# Altium schematic sheet Rectifier_Unit.SchDoc
size A3
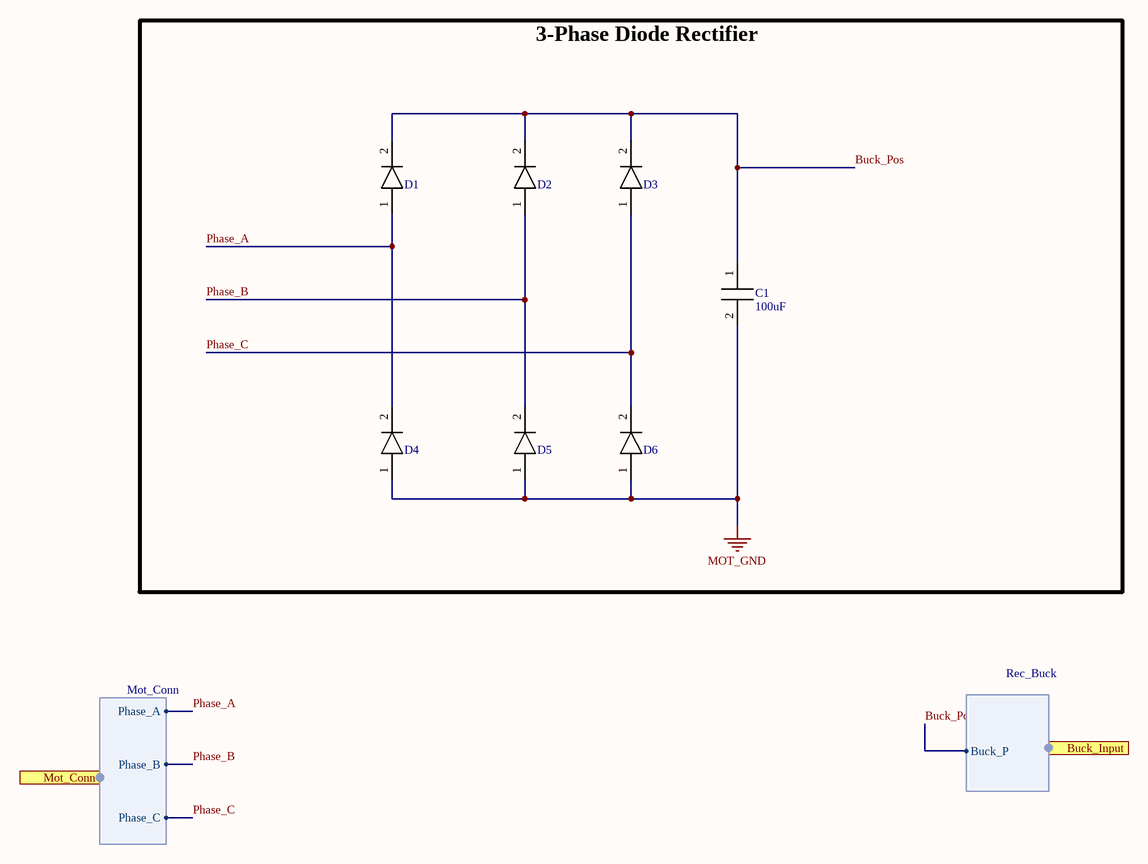
[diagram p0: Rectifier_Unit.SchDoc]

## Parts
C1  Parameter 1: 100uF  [EKXL401ELL101MM25S]  (hidden comment: CAP 100uf EKXL401ELL101MM25S)
D1  DI S2GTR  [S2GTR]  (value not drawn)
D2  DI S2GTR  [S2GTR]  (value not drawn)
D3  DI S2GTR  [S2GTR]  (value not drawn)
D4  DI S2GTR  [S2GTR]  (value not drawn)
D5  DI S2GTR  [S2GTR]  (value not drawn)
D6  DI S2GTR  [S2GTR]  (value not drawn)

## Ports
Buck_Input (harness Rec_Buck), Mot_Conn (harness Mot_Conn)

## Harnesses
Mot_Conn: Phase_A, Phase_B, Phase_C
Rec_Buck: Buck_P

## Nets
MOT_GND: C1.2 D4.1(Anode) D5.1(Anode) D6.1(Anode)
Buck_Pos: C1.1 D1.2(Cathode) D2.2(Cathode) D3.2(Cathode) ; port Buck_Input.Buck_P
Phase_A: D1.1(Anode) D4.2(Cathode) ; port Mot_Conn.Phase_A
Phase_B: D2.1(Anode) D5.2(Cathode) ; port Mot_Conn.Phase_B
Phase_C: D3.1(Anode) D6.2(Cathode) ; port Mot_Conn.Phase_C

## Notes on the sheet
- 3-Phase Diode Rectifier
- Title
- Size:
- Date:
- A3
- Number:
- Time:
- Revision:
- Sheet
- of
- File:

## Library data of the parts
D1-D6 = DI S2GTR: DI, S2GTR, 400V, 2A